# EAGLE design UA18_shield (EAGLE 8.6.1)
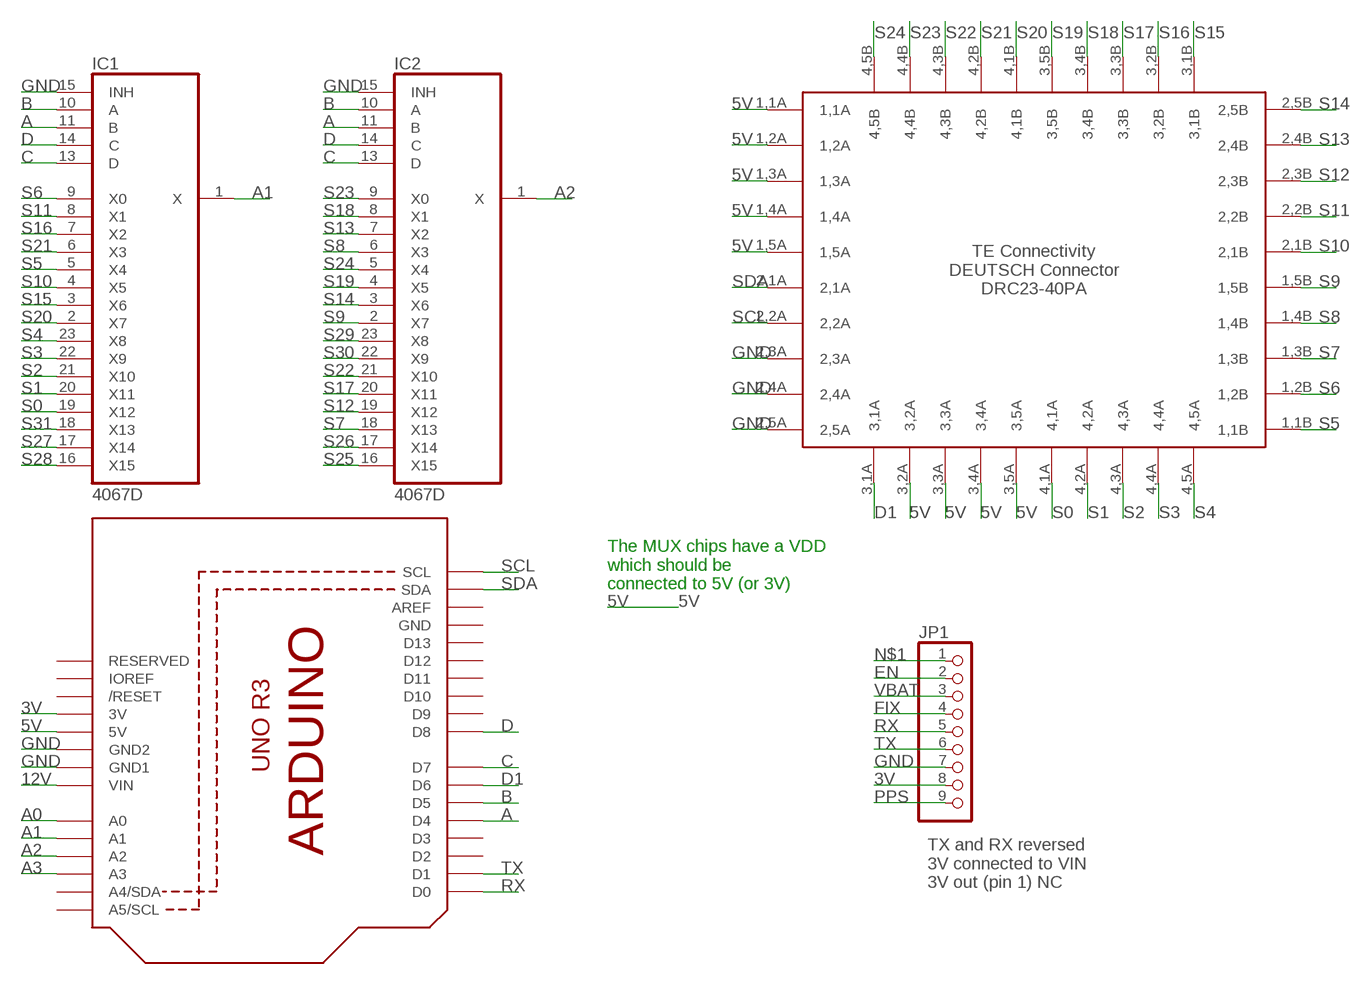
[diagram p0: schematic, sheet 1]

## Parts
IC1  4067D  [SO24W]
IC2  4067D  [SO24W]
JP1  PINHD-1X9  [1X09-BIG]
U2  ARDUINOR3-DIMENSION  [ARDUINOR3]
U$1  DEUTSCH-DRC23-40PA-N012  [DEUTSCH-40P-RECP-ASM]

## Nets
3V: JP1.8 U2.3V
5V: U2.5V U$1.1,1A U$1.1,2A U$1.1,3A U$1.1,4A U$1.1,5A U$1.3,2A U$1.3,3A U$1.3,4A U$1.3,5A
12V: U2.VIN
A: IC1.11(B) IC2.11(B) U2.D4
A0: U2.A0
A1: IC1.1(X) U2.A1
A2: IC2.1(X) U2.A2
A3: U2.A3
B: IC1.10(A) IC2.10(A) U2.D5
C: IC1.13(D) IC2.13(D) U2.D7
D: IC1.14(C) IC2.14(C) U2.D8
D1: U2.D6 U$1.3,1A
EN: JP1.2
FIX: JP1.4
GND: IC1.15(INH) IC2.15(INH) JP1.7 U2.GND1 U2.GND2 U$1.2,3A U$1.2,4A U$1.2,5A
N$1: JP1.1
PPS: JP1.9
RX: JP1.5 U2.D0
S0: IC1.19(X12) U$1.4,1A
S1: IC1.20(X11) U$1.4,2A
S2: IC1.21(X10) U$1.4,3A
S3: IC1.22(X9) U$1.4,4A
S4: IC1.23(X8) U$1.4,5A
S5: IC1.5(X4) U$1.1,1B
S6: IC1.9(X0) U$1.1,2B
S7: IC2.18(X13) U$1.1,3B
S8: IC2.6(X3) U$1.1,4B
S9: IC2.2(X7) U$1.1,5B
S10: IC1.4(X5) U$1.2,1B
S11: IC1.8(X1) U$1.2,2B
S12: IC2.19(X12) U$1.2,3B
S13: IC2.7(X2) U$1.2,4B
S14: IC2.3(X6) U$1.2,5B
S15: IC1.3(X6) U$1.3,1B
S16: IC1.7(X2) U$1.3,2B
S17: IC2.20(X11) U$1.3,3B
S18: IC2.8(X1) U$1.3,4B
S19: IC2.4(X5) U$1.3,5B
S20: IC1.2(X7) U$1.4,1B
S21: IC1.6(X3) U$1.4,2B
S22: IC2.21(X10) U$1.4,3B
S23: IC2.9(X0) U$1.4,4B
S24: IC2.5(X4) U$1.4,5B
S25: IC2.16(X15)
S26: IC2.17(X14)
S27: IC1.17(X14)
S28: IC1.16(X15)
S29: IC2.23(X8)
S30: IC2.22(X9)
S31: IC1.18(X13)
SCL: U2.SCL U$1.2,2A
SDA: U2.SDA U$1.2,1A
TX: JP1.6 U2.D1
VBAT: JP1.3
Unconnected: U2.A4(A4/SDA) U2.A5(A5/SCL) U2.AREF U2.D2 U2.D3 U2.D9 U2.D10 U2.D11 U2.D12 U2.D13 U2.IOREF U2.RESERVED U2.RESET(/RESET)

## Notes on the sheet
- The MUX chips have a VDD
  which should be
  connected to 5V (or 3V)
- TX and RX reversed
  3V connected to VIN
  3V out (pin 1) NC

## Power pins joined to a net without a drawn wire
5V: IC1.24(VDD) IC2.24(VDD)
GND: U2.GND
VSS: IC1.12(VSS) IC2.12(VSS)

## Library data of the parts
IC1 IC2 = 40xx:4067: 16-channel ANALOG MULTIPLEXER
JP1 = adafruit:PINHD-1X9: Pin header 1x10 0.1" spacing With round pins
U2 = adafruit:ARDUINOR3: This is a new object for the new Arduino R3 - with extra pins that you may want to use (such as IOref, and duplicated A4/A5
U$1 = DEUTSCH_FRED:DEUTSCH-DRC23-40PA-N012

## Board
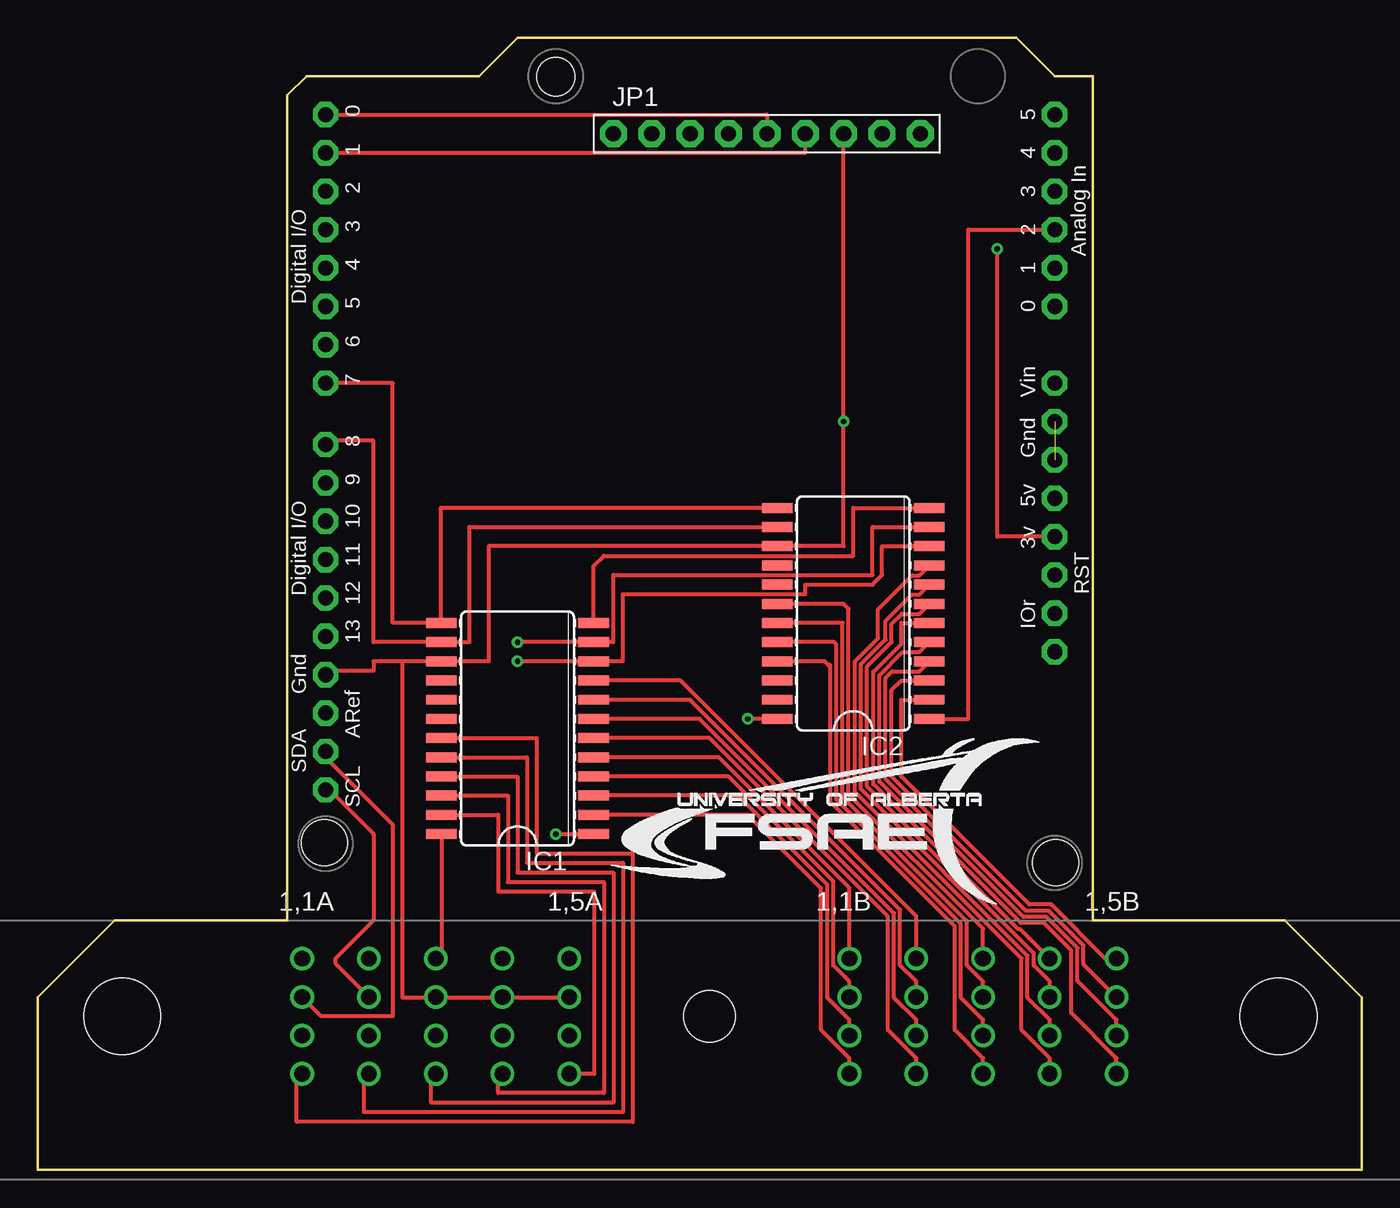
[diagram p1: board, top side]
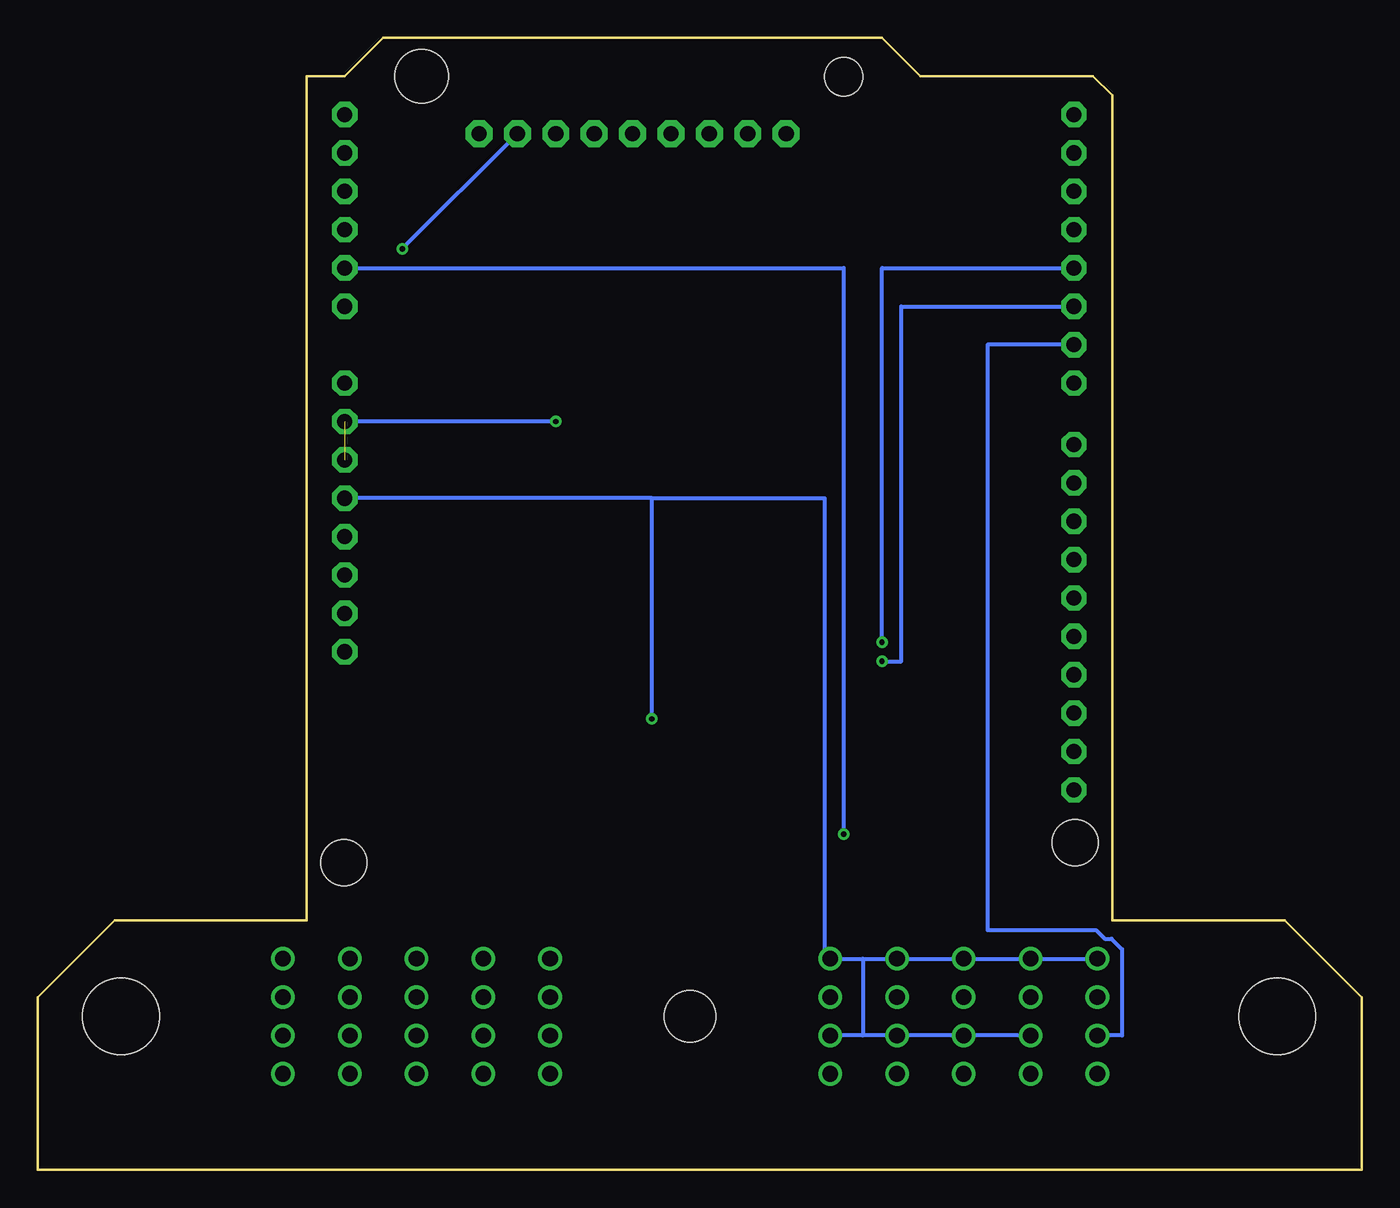
[diagram p2: board, bottom side, seen from below]

Size 87.63 x 74.93 mm. Coordinates in mm from the lower left corner, seen from the top.
Outline: 69.85,72.39 69.85,16.51 82.55,16.51 87.63,11.43 87.63,0 0,0 0,11.43 5.08,16.51 16.51,16.51 16.51,71.12 17.78,72.39 29.21,72.39 31.75,74.93 64.77,74.93 67.31,72.39 69.85,72.39
Copper layers (1*16): Top 0.035mm / dielectric 1.5mm / Bottom 0.035mm
Design rules "default": minimum track width 6mil, minimum drill 0.35mm, track to track 6mil, track to pad 6mil, pad to pad 6mil, via to via 6mil, smd to smd 6mil, copper to edge 40mil, drill to drill 6mil, minimum pad ring 10mil, minimum via ring 8mil, stop-mask expansion 4mil, vias tented up to drill 0mil, thermal gap 10mil
Holes 3.05 mm at 18.97,21.67 67.36,20.32
Holes 3.56 mm at 62.23,72.39
Holes 2.54 mm at 34.29,72.36

### Footprints (pad centres in the part's own frame; a part is rotated, then mirrored left to right if it is on the bottom)
SO24W = smd 0.66 x 2.032: 1 -6.985,-5.029; 2 -5.715,-5.029; 3 -4.445,-5.029; 4 -3.175,-5.029; 5 -1.905,-5.029; 6 -0.635,-5.029; 7 0.635,-5.029; 8 1.905,-5.029; 9 3.175,-5.029; 10 4.445,-5.029; 11 5.715,-5.029; 12 6.985,-5.029; 13 6.985,5.029; 14 5.715,5.029; 15 4.445,5.029; 16 3.175,5.029; 17 1.905,5.029; 18 0.635,5.029; 19 -0.635,5.029; 20 -1.905,5.029; 21 -3.175,5.029; 22 -4.445,5.029; 23 -5.715,5.029; 24 -6.985,5.029
1X09-BIG = drill 1.016 pad 1.778 octagon: 1 -10.16,0; 2 -7.62,0; 3 -5.08,0; 4 -2.54,0; 5 0,0; 6 2.54,0; 7 5.08,0; 8 7.62,0; 9 10.16,0
ARDUINOR3 = drill 1 pad 1.676 octagon: 3V 35.56,2.54; 5V 38.1,2.54; A0 50.8,2.54; A1 53.34,2.54; A2 55.88,2.54; A3 58.42,2.54; A4 60.96,2.54; A5 63.5,2.54; AREF 23.876,50.8; D0 63.5,50.8; D1 60.96,50.8; D2 58.42,50.8; D3 55.88,50.8; D4 53.34,50.8; D5 50.8,50.8; D6 48.26,50.8; D7 45.72,50.8; D8 41.656,50.8; D9 39.116,50.8; D10 36.576,50.8; D11 34.036,50.8; D12 31.496,50.8; D13 28.956,50.8; GND 26.416,50.8; GND1 43.18,2.54; GND2 40.64,2.54; IOREF 30.48,2.54; RESERVED 27.94,2.54; RESET 33.02,2.54; SCL 18.796,50.8; SDA 21.336,50.8; VIN 45.72,2.54
DEUTSCH-40P-RECP-ASM = drill 1.041: 1,1A -26.949,3.81; 1,1B 9.271,3.81; 1,2A -22.53,3.81; 1,2B 13.691,3.81; 1,3A -18.11,3.81; 1,3B 18.11,3.81; 1,4A -13.691,3.81; 1,4B 22.53,3.81; 1,5A -9.271,3.81; 1,5B 26.949,3.81; 2,1A -26.949,1.27; 2,1B 9.271,1.27; 2,2A -22.53,1.27; 2,2B 13.691,1.27; 2,3A -18.11,1.27; 2,3B 18.11,1.27; 2,4A -13.691,1.27; 2,4B 22.53,1.27; 2,5A -9.271,1.27; 2,5B 26.949,1.27; 3,1A -26.949,-1.27; 3,1B 9.271,-1.27; 3,2A -22.53,-1.27; 3,2B 13.691,-1.27; 3,3A -18.11,-1.27; 3,3B 18.11,-1.27; 3,4A -13.691,-1.27; 3,4B 22.53,-1.27; 3,5A -9.271,-1.27; 3,5B 26.949,-1.27; 4,1A -26.949,-3.81; 4,1B 9.271,-3.81; 4,2A -22.53,-3.81; 4,2B 13.691,-3.81; 4,3A -18.11,-3.81; 4,3B 18.11,-3.81; 4,4A -13.691,-3.81; 4,4B 22.53,-3.81; 4,5A -9.271,-3.81; 4,5B 26.949,-3.81 | hole 3.404: 0,0 | hole 5.08: 37.668,0; -38.862,0

### Placement (x,y rotation side)
IC1  31.75,29.21 90 top
IC2  53.97,36.83 90 top
JP1  48.26,68.58 0 top
U2  69.85,6.35 90 top
U$1  44.45,10.16 0 top

### Tracks (layer width: path | path; a pad name or v marks a point on that pad's centre or on a via)
3V  (via drill 0.35)
  Top 0.254: U2.3V 63.5,41.91 v63.5,60.96
  Bottom 0.254: v63.5,60.96 JP1.8
5V  (via drill 0.35)
  Top 0.254: IC1.24 26.72,14.35 U$1.1,3A | IC2.24 v46.99,29.85
  Bottom 0.254: 46.99,44.45 35.56,44.45 35.56,13.97 U$1.1,5A 33.02,13.97 | 46.99,44.45 U2.5V | 33.02,13.97 U$1.1,4A U$1.1,3A U$1.1,2A U$1.1,1A | v46.99,29.85 46.99,44.45 | U$1.3,2A U$1.3,3A U$1.3,4A 33.02,8.89 | 33.02,8.89 U$1.3,5A | 33.02,13.97 33.02,8.89
A  (via drill 0.35)
  Top 0.254: IC2.11 55.25,42.55 55.25,39.37 38.1,39.37 38.1,34.93 IC1.11 v31.75,34.93
  Bottom 0.254: U2.D4 31.75,59.69 v31.75,34.93
A1  (via drill 0.35)
  Top 0.254: v34.29,22.23 IC1.1
  Bottom 0.254: U2.A1 34.29,59.69 v34.29,22.23
A2
  Top 0.254: U2.A2 61.59,62.23 61.59,29.85 IC2.1
B  (via drill 0.35)
  Top 0.254: v31.75,33.66 IC1.10 38.73,33.66 38.73,38.1 50.8,38.1 50.8,38.74 55.25,38.74 55.88,39.37 55.88,41.28 IC2.10
  Bottom 0.254: v31.75,33.66 30.48,33.66 30.48,57.15 U2.D5
C
  Top 0.254: IC2.13 26.67,43.82 26.67,36.25 IC1.13 23.49,36.2 23.49,52.07 U2.D7
D
  Top 0.254: IC2.14 28.57,42.55 28.57,34.93 IC1.14 22.23,34.93 22.23,48.26 19.3,48.26 U2.D8
D1
  Bottom 0.254: U2.D6 24.77,54.61 24.77,15.88 17.6,15.88 17.02,15.29 16.56,15.29 15.88,14.61 15.88,8.89 U$1.3,1A
GND  (via drill 0.35)  (1 unrouted)
  Top 0.254: JP1.7 v53.34,49.53 53.34,41.28 IC2.15 29.84,41.28 29.84,33.66 IC1.15 24.13,33.66 | 24.13,33.66 22.23,33.66 22.23,33.02 19.3,33.02 U2.GND | 24.13,33.66 24.13,11.43 U$1.2,3A U$1.2,4A U$1.2,5A
  Bottom 0.254: v53.34,49.53 U2.GND1
RX
  Top 0.254: U2.D0 48.26,69.85 JP1.5
S0
  Top 0.254: IC1.19 33.02,28.58 33.02,22.52 33,22.5 33,21.95 33.02,21.93 33.02,20.96 39.37,20.96 39.37,3.18 17.14,3.18 17.14,5.99 U$1.4,1A
S1
  Top 0.254: IC1.20 32.38,27.31 32.38,20.32 38.73,20.32 38.73,3.81 21.59,3.81 21.59,6.02 U$1.4,2A
S2
  Top 0.254: IC1.21 31.75,26.04 31.75,19.69 38.1,19.69 38.1,4.45 26.04,4.45 26.04,6.05 U$1.4,3A
S3
  Top 0.254: IC1.22 31.11,24.77 31.11,19.05 37.47,19.05 37.47,5.08 30.48,5.08 30.48,6.07 U$1.4,4A
S4
  Top 0.254: IC1.23 30.48,23.5 30.48,18.42 36.83,18.42 36.83,6.35 U$1.4,5A
S5
  Top 0.254: U$1.1,1B 53.72,18.67 45.08,27.31 IC1.5
S6
  Top 0.254: U$1.1,2B 58.14,16.79 42.55,32.39 IC1.9
S7
  Top 0.254: U$1.1,3B 62.56,15.97 53.67,24.86 53.67,37.14 53.34,37.47 IC2.18
S8
  Top 0.254: U$1.1,4B 65.02,15.93 64.9,15.93 55.3,25.53 55.3,32.96 57.15,34.81 57.15,36.2 IC2.6
S9
  Top 0.254: U$1.1,5B 70.67,13.97 67.08,17.55 65.63,17.55 57.15,26.04 57.15,31.12 IC2.2
S10
  Top 0.254: U$1.2,1B 53.72,12.47 52.66,13.53 52.66,19.09 45.72,26.04 IC1.4
S11
  Top 0.254: U$1.2,2B 58.14,12.47 57.08,13.53 57.08,17.22 43.18,31.12 IC1.8
S12
  Top 0.254: U$1.2,3B 62.56,12.47 61.5,13.53 61.5,16.45 53.26,24.69 53.26,36.2 IC2.19
S13
  Top 0.254: U$1.2,4B 66.98,12.47 65.92,13.53 65.92,14.33 54.89,25.36 54.89,33.3 56.52,34.93 56.52,36.14 57.19,36.81 58.34,36.81 IC2.7
S14
  Top 0.254: U$1.2,5B 69.22,13.61 69.22,14.85 66.92,17.15 65.41,17.15 56.52,26.04 56.52,31.75 57.15,32.39 IC2.3
S15
  Top 0.254: U$1.3,1B 53.72,9.93 52.25,11.4 52.25,18.87 46.36,24.77 IC1.3
S16
  Top 0.254: U$1.3,2B 58.14,9.93 56.67,11.4 56.67,16.99 43.81,29.85 IC1.7
S17
  Top 0.254: U$1.3,3B 62.56,9.93 61.09,11.4 61.09,16.28 52.86,24.52 52.86,34.77 52.7,34.93 IC2.20
S18
  Top 0.254: U$1.3,4B 66.98,9.93 65.51,11.4 65.51,14.16 54.48,25.19 54.48,33.47 56.11,35.09 56.11,36.31 57.87,38.08 58.34,38.08 IC2.8
S19
  Top 0.254: U$1.3,5B 71.4,9.93 68.81,12.52 68.81,14.68 66.75,16.74 65.24,16.74 56.11,25.87 56.11,32.55 56.55,33 58.34,33 IC2.4
S20
  Top 0.254: U$1.4,1B 53.72,7.39 51.85,9.26 51.85,18.64 46.99,23.5 IC1.2
S21
  Top 0.254: U$1.4,2B 58.14,7.39 56.27,9.26 56.27,16.76 44.45,28.58 IC1.6
S22
  Top 0.254: U$1.4,3B 62.56,7.39 60.69,9.26 60.69,16.12 52.45,24.35 52.45,33.4 52.32,33.4 52.07,33.66 IC2.21
S23
  Top 0.254: U$1.4,4B 66.98,7.39 65.11,9.26 65.11,14 54.08,25.03 54.08,33.64 55.62,35.18 55.62,37.1 57.87,39.35 58.34,39.35 IC2.9
S24
  Top 0.254: U$1.4,5B 71.4,7.39 68.4,10.39 68.4,14.51 66.58,16.33 65.07,16.33 55.7,25.7 55.7,32.72 57.25,34.27 58.34,34.27 IC2.5
SCL
  Top 0.254: U2.SCL 19.3,25.15 22.23,22.23 22.23,16.51 19.68,13.97 19.68,13.67 U$1.2,2A
SDA
  Top 0.254: U2.SDA 19.05,27.31 23.49,22.86 23.49,10.16 18.77,10.16 U$1.2,1A
TX
  Top 0.254: U2.D1 50.8,67.31 JP1.6
VSS
  Top 0.254: IC1.12 36.78,39.95 37.47,40.64 53.97,40.64 53.97,43.82 IC2.12